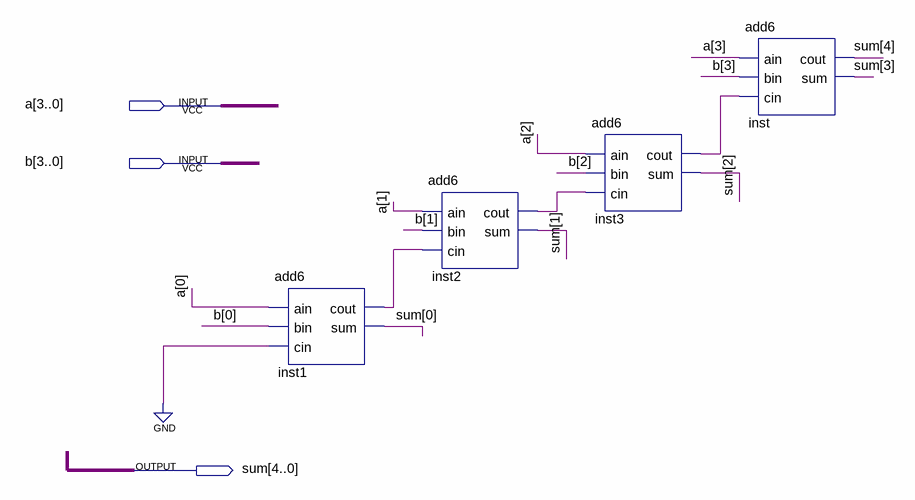
[diagram p0: schematic sheet]
// Quartus schematic add7.bdf as structural Verilog: 4 symbols, 3 pins
module add7 (
  input  [3:0] a,
  input  [3:0] b,
  output [4:0] sum
);

  wire inst1_cout, inst2_cout, inst3_cout;

  add6 inst1 (.ain(a[0]), .bin(b[0]), .cin(1'b0), .cout(inst1_cout), .sum(sum[0]));
  add6 inst2 (.ain(a[1]), .bin(b[1]), .cin(inst1_cout), .cout(inst2_cout), .sum(sum[1]));
  add6 inst3 (.ain(a[2]), .bin(b[2]), .cin(inst2_cout), .cout(inst3_cout), .sum(sum[2]));
  add6 inst (.ain(a[3]), .bin(b[3]), .cin(inst3_cout), .cout(sum[4]), .sum(sum[3]));
endmodule
